# EAGLE design LTEbee_adapter_rev1b (EAGLE 7.5.0)
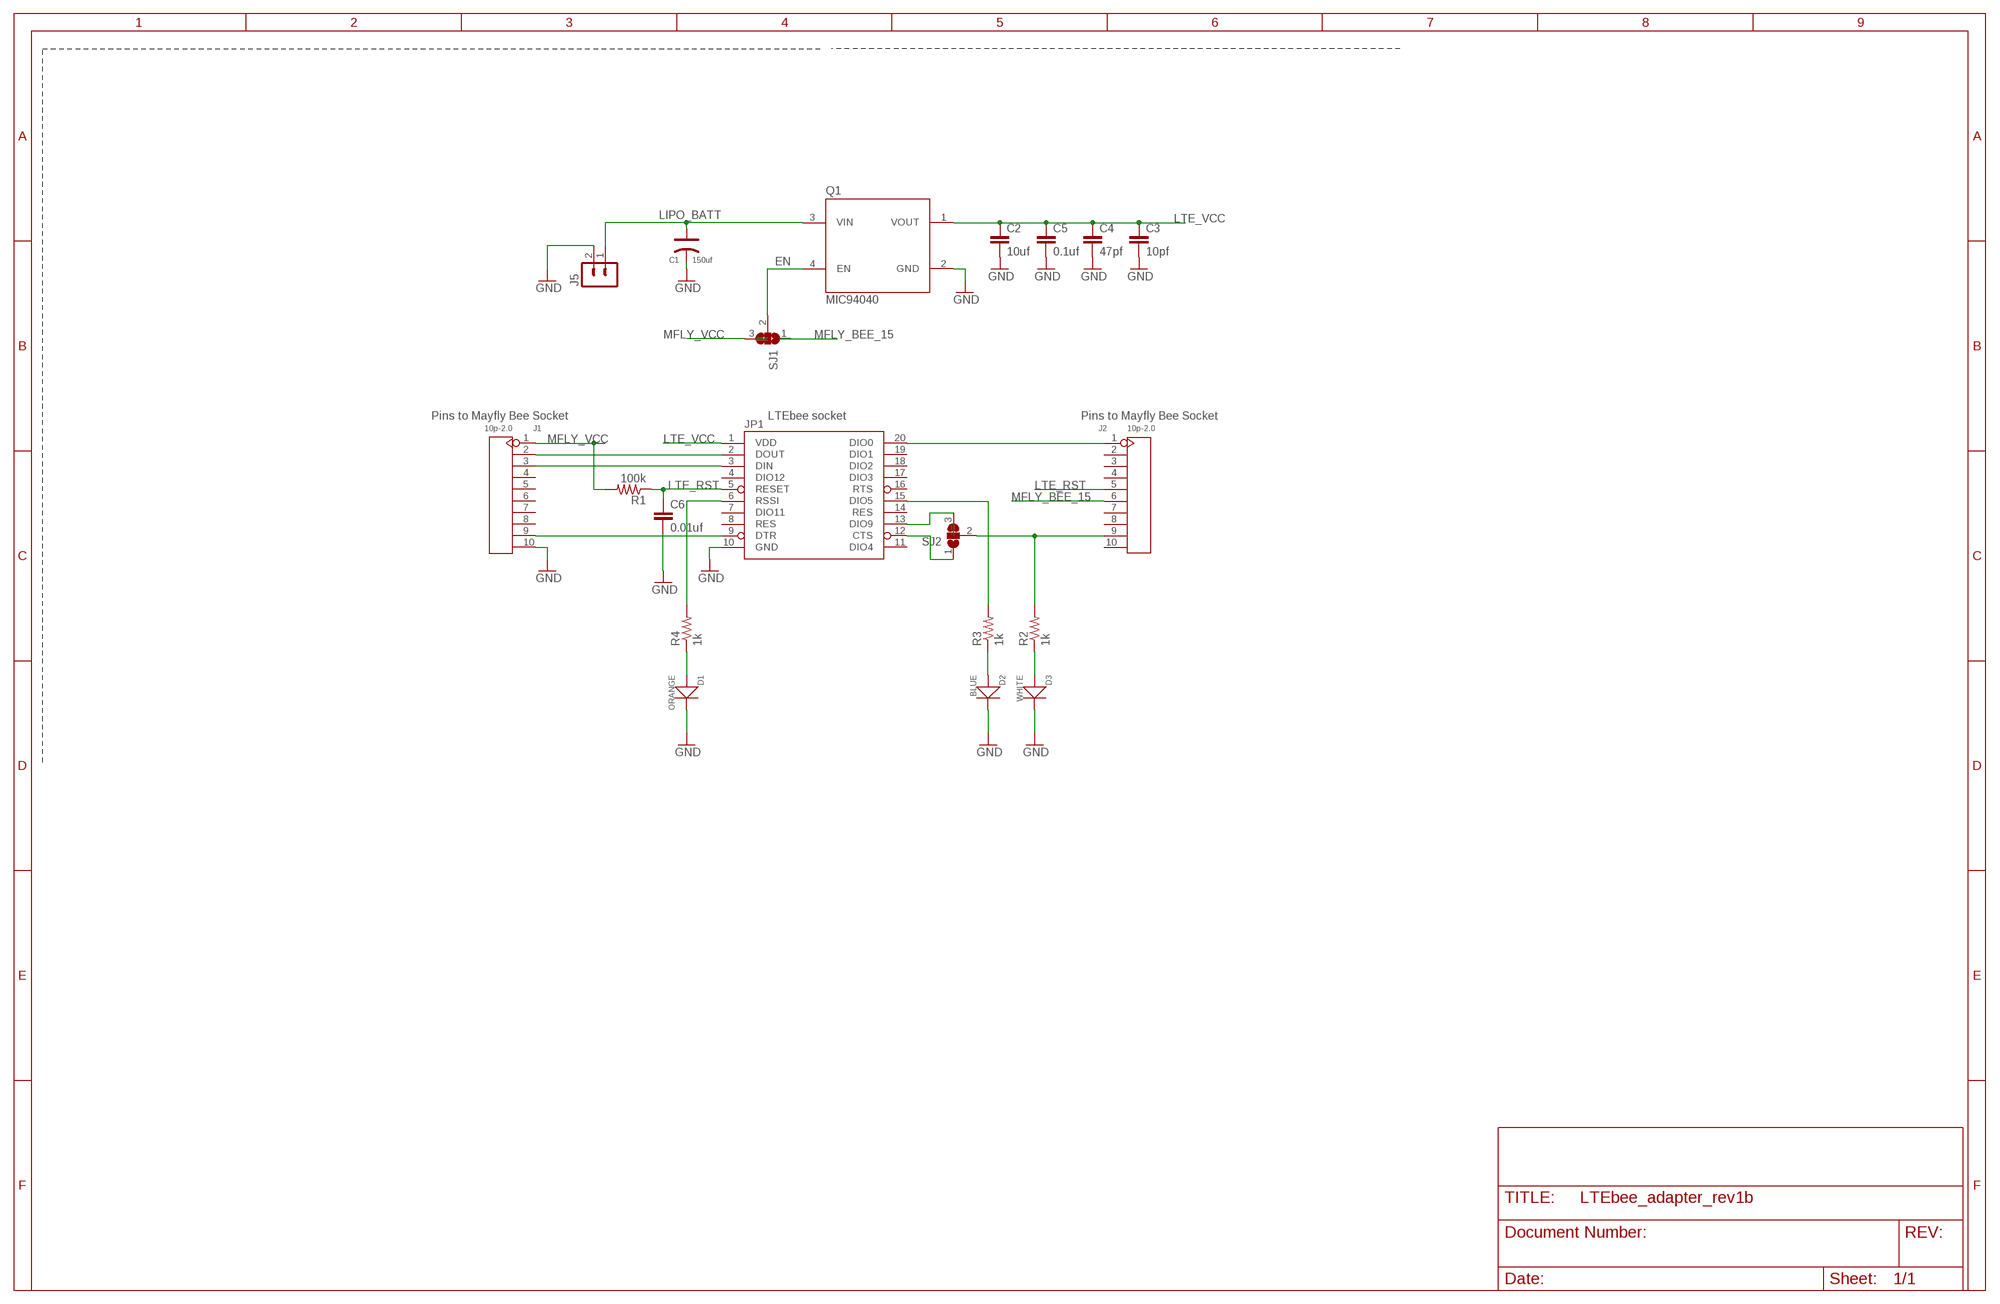
[diagram p0: schematic, sheet 1]

## Parts
C1  150uf  TANTALUM-SMD-100UF-10V(AVX-B)  [AVX-B]
C2  10uf  CAP0402-CAP  [0402-CAP]
C3  10pf  CAP0402-CAP  [0402-CAP]
C4  47pf  CAP0402-CAP  [0402-CAP]
C5  0.1uf  CAP0402-CAP  [0402-CAP]
C6  0.01uf  CAP0402-CAP  [0402-CAP]
D1  ORANGE  DIODE'0603'  [SOD-523]
D2  BLUE  DIODE'0603'  [SOD-523]
D3  WHITE  DIODE'0603'  [SOD-523]
J1  10p-2.0  DIP-BLACK-FEMALE-HEADER-VERT(10P-2.0)  [H10-2.0]
J2  10p-2.0  DIP-BLACK-FEMALE-HEADER-VERT(10P-2.0)  [H10-2.0]
J5  B2B-PH-K-S  [B2B-PH-K-S]
JP1  XBEE-1B1  [XBEE-1]
Q1  MIC94040  [MLF4]
R1  100k  RESISTOR0603  [0603-RES]
R2  1k  RESISTOR0603  [0603-RES]
R3  1k  RESISTOR0603  [0603-RES]
R4  1k  RESISTOR0603  [0603-RES]
SJ1  SJ2W  [SJ_2]
SJ2  SJ2W  [SJ_2]

## Nets
EN: Q1.4(EN) SJ1.2
GND: C1.- C2.2 C3.2 C4.2 C5.2 C6.2 D1.- D2.- D3.- J1.10 J5.2 JP1.10(GND) Q1.2(GND)
LIPO_BATT: C1.+ J5.1 Q1.3(VIN)
LTE_RST: C6.1 J2.5 JP1.5(RESET) R1.1
LTE_VCC: C2.1 C3.1 C4.1 C5.1 JP1.1(VDD) Q1.1(VOUT)
MFLY_BEE_15: J2.6 SJ1.1
MFLY_VCC: J1.1 R1.2 SJ1.3
N$1: J1.2 JP1.2(DOUT)
N$2: J1.3 JP1.3(DIN)
N$3: JP1.6(RSSI) R4.2
N$4: D1.+ R4.1
N$5: D3.+ R2.1
N$6: D2.+ R3.1
N$7: J2.9 R2.2 SJ2.2
N$8: JP1.15(DIO5) R3.2
N$9: J2.1 JP1.20(DIO0)
N$10: J1.9 JP1.9(DTR)
N$11: JP1.13(DIO9) SJ2.3
N$13: JP1.12(CTS) SJ2.1
Unconnected: J1.4 J1.5 J1.6 J1.7 J1.8 J2.2 J2.3 J2.4 J2.7 J2.8 J2.10 JP1.4(DIO12) JP1.7(DIO11) JP1.8(RES) JP1.11(DIO4) JP1.14(RES) JP1.16(RTS) JP1.17(DIO3) JP1.18(DIO2) JP1.19(DIO1)

## Notes on the sheet
- Pins to Mayfly Bee Socket | LTEbee socket | Pins to Mayfly Bee Socket

## Library data of the parts
C1 = Seeed-OPL-Capacitor:TANTALUM-SMD-100UF-10V(AVX-B): 302020015; MPN: TAJB107M010#NJ; VALUE: 100uf
C2-C6 = SparkFun-Capacitors:CAP: Capacitor Standard 0603 ceramic capacitor, and 0.1" leaded capacitor.
D1-D3 = Seeed-OPL-Diode:DIODE*
J1 J2 = Seeed-OPL-Connector:DIP-BLACK-FEMALE-HEADER-VERT(10P-2.0): 320030009; MPN: F243-1110A1BSUA1
J5 = con-JST PH:B2B-PH: JST PH series header 2.00mm pitch disconnectable crimp style connectors, vertical (side entry type), 2 pins
JP1 = SparkFun-RF:XBEE-1: Xbee module footprints
Q1 = SDH_custom:MIC94040
R1-R4 = SparkFun-Resistors:RESISTOR: Resistor Basic schematic elements and footprints for 0603, 1206, and PTH resistors.
SJ1 SJ2 = jumper:SJ2W: SMD solder JUMPER

## Board
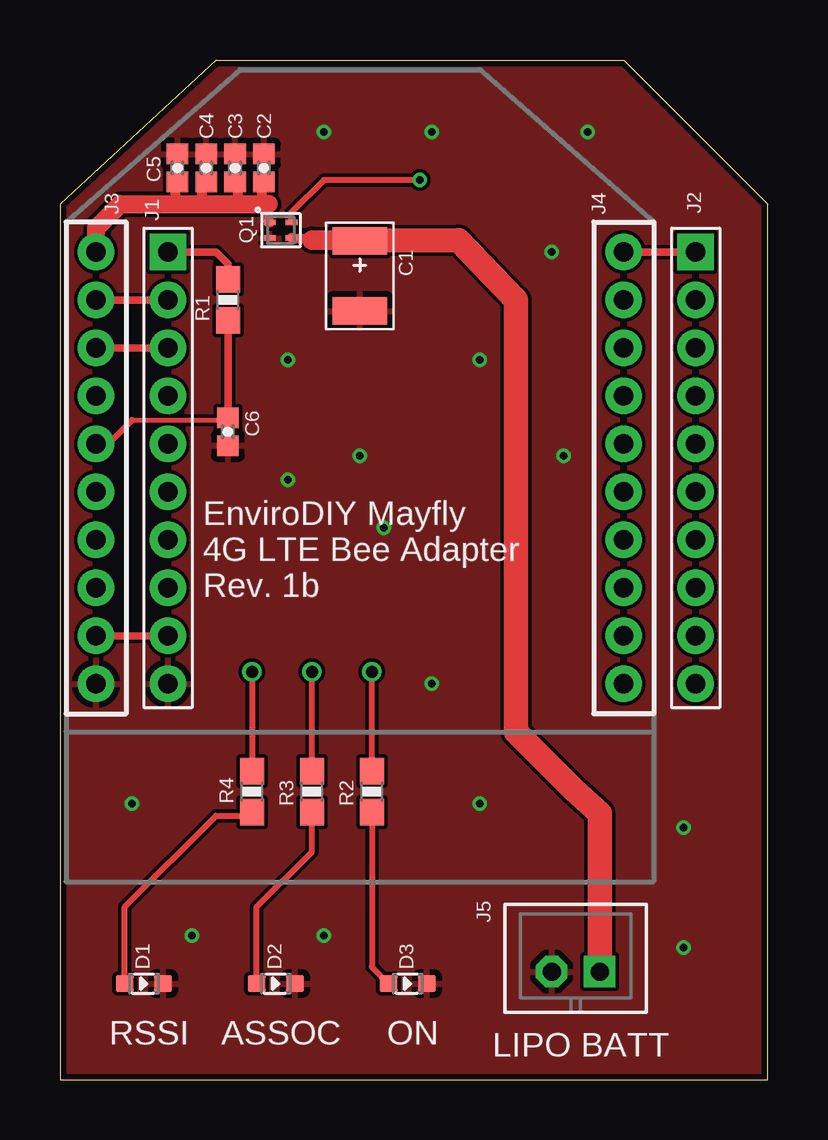
[diagram p1: board, top side]
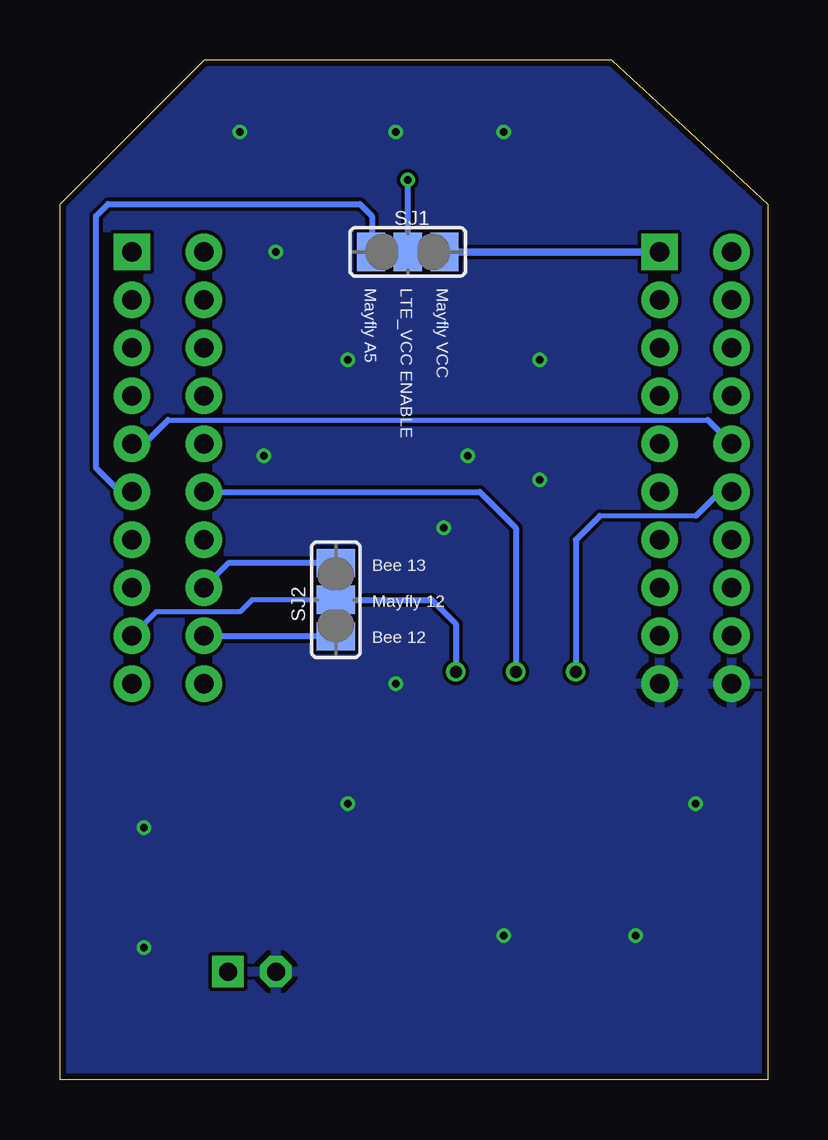
[diagram p2: board, bottom side, seen from below]

Size 29.5 x 42.5 mm. Coordinates in mm from the lower left corner, seen from the top.
Outline: 0,36.5 0,0 29.5,0 29.5,36.5 23.5,42.5 6.5,42.5 0,36.5
Copper layers (1*16): Top 0.035mm / dielectric 1.5mm / Bottom 0.035mm
Design rules "SeeedStudio_2layer_DRU_no_angle_20140221": minimum track width 6mil, minimum drill 12mil, track to track 6mil, track to pad 6mil, pad to pad 6mil, via to via 6mil, smd to smd 0mil, copper to edge 10mil, drill to drill 10mil, minimum pad ring 10mil, minimum via ring 6mil, stop-mask expansion 2mil, vias tented up to drill 100mil, thermal gap 10mil

### Footprints (pad centres in the part's own frame; a part is rotated, then mirrored left to right if it is on the bottom)
AVX-B = smd 1.143 x 2.286: + -1.46,0; - 1.46,0
0402-CAP = smd 0.85 x 0.9: 1 -0.58,0; 2 0.58,0
SOD-523 = smd 0.762 x 0.7: + -0.8,0; - 0.8,0
H10-2.0 = drill 0.813 pad 1.524 square: 1 0,9 | drill 0.813 pad 1.524: 2 0,7; 3 0,5; 4 0,3; 5 0,1; 6 0,-1; 7 0,-3; 8 0,-5; 9 0,-7; 10 0,-9
B2B-PH-K-S = drill 0.75 pad 1.3 square: 1 1,0 | drill 0.75 pad 1.3 octagon: 2 -1,0
XBEE-1 = drill 0.8 pad 1.524: 1 -11,20; 2 -11,18; 3 -11,16; 4 -11,14; 5 -11,12; 6 -11,10; 7 -11,8; 8 -11,6; 9 -11,4; 10 -11,2; 11 11,2; 12 11,4; 13 11,6; 14 11,8; 15 11,10; 16 11,12; 17 11,14; 18 11,16; 19 11,18; 20 11,20
MLF4 = smd 0.23 x 0.49: 1 -0.324,-0.454; 2 0.324,-0.452; 3 0.324,0.455; 4 -0.325,0.455
0603-RES = smd 1.1 x 1: 1 -0.85,0; 2 0.85,0
SJ_2 = smd 1.168 x 1.6: 1 -1.524,0; 2 0,0; 3 1.524,0

### Placement (x,y rotation side)
C1  12.5,33.5 270 top
C2  8.5,38 90 top
C3  7.3,38 90 top
C4  6.1,38 90 top
C5  4.9,38 90 top
C6  7,27 270 top
D1  3.5,4 0 top
D2  9,4 0 top
D3  14.5,4 0 top
J1  4.5,25.5 0 top
J2  26.5,25.5 0 top
J5  21.5,4.5 0 top
JP1  12.5,14.5 0 top
Q1  9.2,35.4 270 top
R1  7,32.5 90 top
R2  13,12 90 top
R3  10.5,12 90 top
R4  8,12 90 top
SJ1  15,34.5 0 bottom
SJ2  18,20 90 bottom

### Tracks (layer width: path | path; a pad name or v marks a point on that pad's centre or on a via)
EN  (via drill 0.3)
  Top 0.254: v15,37.5 11,37.5 9.65,36.16 Q1.4
  Bottom 0.254: v15,37.5 SJ1.2 13.5,34.5
GND  (via drill 0.3)
  other vias: 9.5,30 17.5,30 9.5,25 13.5,23 11,39.5 15.5,39.5 22,39.5 15.5,16.5 17.5,11.5 3,11.5 5.5,6 11,6 26,5.5 26,10.5 12.5,26 21,26 20.5,34.5
  pour Bottom: -0.7,44.54 30.3,44.54 30.1,-0.7 -0.6,-0.6
  pour Top: -1.3,45.04 31,45.24 30.6,-1.2 -1.1,-1.2
LIPO_BATT
  Top 0.406: Q1.3 10.36,35.05 10.5,35 | 12,35 12.5,34.71 C1.+
  Top 0.76: 22.5,5.1 J5.1
  Top 0.813: 10.5,35 12,35
  Top 1.016: C1.+ 16.61,34.99 19,32.5 19,14.5 21.4,12.1 22.5,11.1 22.5,5.1
LTE_RST
  Top 0.2: 3,27.5 6.92,27.5
  Top 0.25: 2,26.5 3,27.5
  Top 0.305: JP1.5 2,26.5 | 6.92,27.5 C6.1 R1.1
  Bottom 0.2: 25,27.5 2.5,27.5
  Bottom 0.25: J2.5 26,26.5 25,27.5 | 2.5,27.5 JP1.5
LTE_VCC
  Top 0.406: Q1.1 8.7,35.72 8.7,36.5 | C4.1 5.9,37.42 5.9,36.5 | C3.1 7.4,37.42 7.4,36.5 | C2.1 8.4,37.42 8.4,36.5 | C5.1 4.8,37.42 4.8,36.5
  Top 0.76: JP1.1 1.5,35.5 2.5,36.5 4.8,36.5 5.9,36.5 7.4,36.5 8.4,36.5 8.7,36.5
MFLY_BEE_15
  Bottom 0.254: J2.6 27,24.5 28,25.5 28,36 27.5,36.5 17,36.5 16.5,36 16.5,34.52 SJ1.1
MFLY_VCC
  Top 0.305: J1.1 6.5,34.5 7,34 R1.2
  Bottom 0.305: SJ1.3 J1.1
N$1
  Top 0.305: JP1.2 J1.2
N$2
  Top 0.305: JP1.3 J1.3
N$3  (via drill 0.5)
  Top 0.25: v8,17 R4.2
  Bottom 0.2: 3,23.5 7,23.5
  Bottom 0.25: JP1.6 2,24.5 3,23.5 | 7,23.5 8,22.5 v8,17
N$4
  Top 0.25: D1.+ 2.7,7.2 6.5,11 7.85,11
  Top 0.305: 7.85,11 R4.1
N$5
  Top 0.25: R2.1 13,4.7 D3.+
N$6
  Top 0.25: D2.+ 8.2,7.2 10.5,9.5 R3.1
N$7  (via drill 0.5)
  Top 0.25: R2.2 v13,17
  Bottom 0.2: SJ2.2 21.5,20 22,19.5 25.5,19.5 J2.9
  Bottom 0.25: 13,19 v13,17
  Bottom 0.254: 13,19 14,20 SJ2.2 18,21.5
N$8  (via drill 0.5)
  Top 0.25: R3.2 v10.5,17
  Bottom 0.25: JP1.15 12,24.5 10.5,23 v10.5,17
N$9
  Top 0.305: JP1.20 J2.1
N$10
  Top 0.305: JP1.9 J1.9
N$11
  Bottom 0.254: SJ2.3 22.48,21.52 JP1.13
N$13
  Bottom 0.254: SJ2.1 23.48,18.48 JP1.12

### Text on the board
tPlace: J3 | J4 | EnviroDIY Mayfly / 4G LTE Bee Adapter / Rev. 1b | RSSI | ASSOC | ON | LIPO BATT
bPlace: Mayfly VCC | LTE_VCC ENABLE | Mayfly A5 | Bee 13 | Mayfly 12 | Bee 12